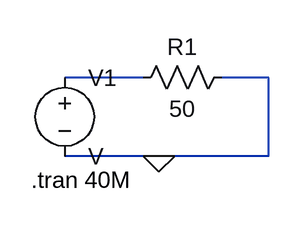
[diagram p0: schematic Draft11.asc]
Draft11.asc, the LTspice schematic file:
Version 4
SHEET 1 880 680
WIRE 128 80 48 80
WIRE 256 80 208 80
WIRE 144 160 48 160
WIRE 256 160 256 80
WIRE 256 160 144 160
FLAG 144 160 0
SYMBOL voltage 48 64 R0
WINDOW 123 0 0 Left 0
WINDOW 39 0 0 Left 0
SYMATTR InstName V1
SYMBOL res 224 64 R90
WINDOW 0 0 56 VBottom 2
WINDOW 3 32 56 VTop 2
SYMATTR InstName R1
SYMATTR Value 50
TEXT 14 184 Left 2 !.tran 40M

The netlist it stands for:
* Draft11.asc
V1 N001 0 V
R1 0 N001 50
.tran 40M
.backanno
.end